# EAGLE design HiJack_ProtoBoard (EAGLE 5.09)
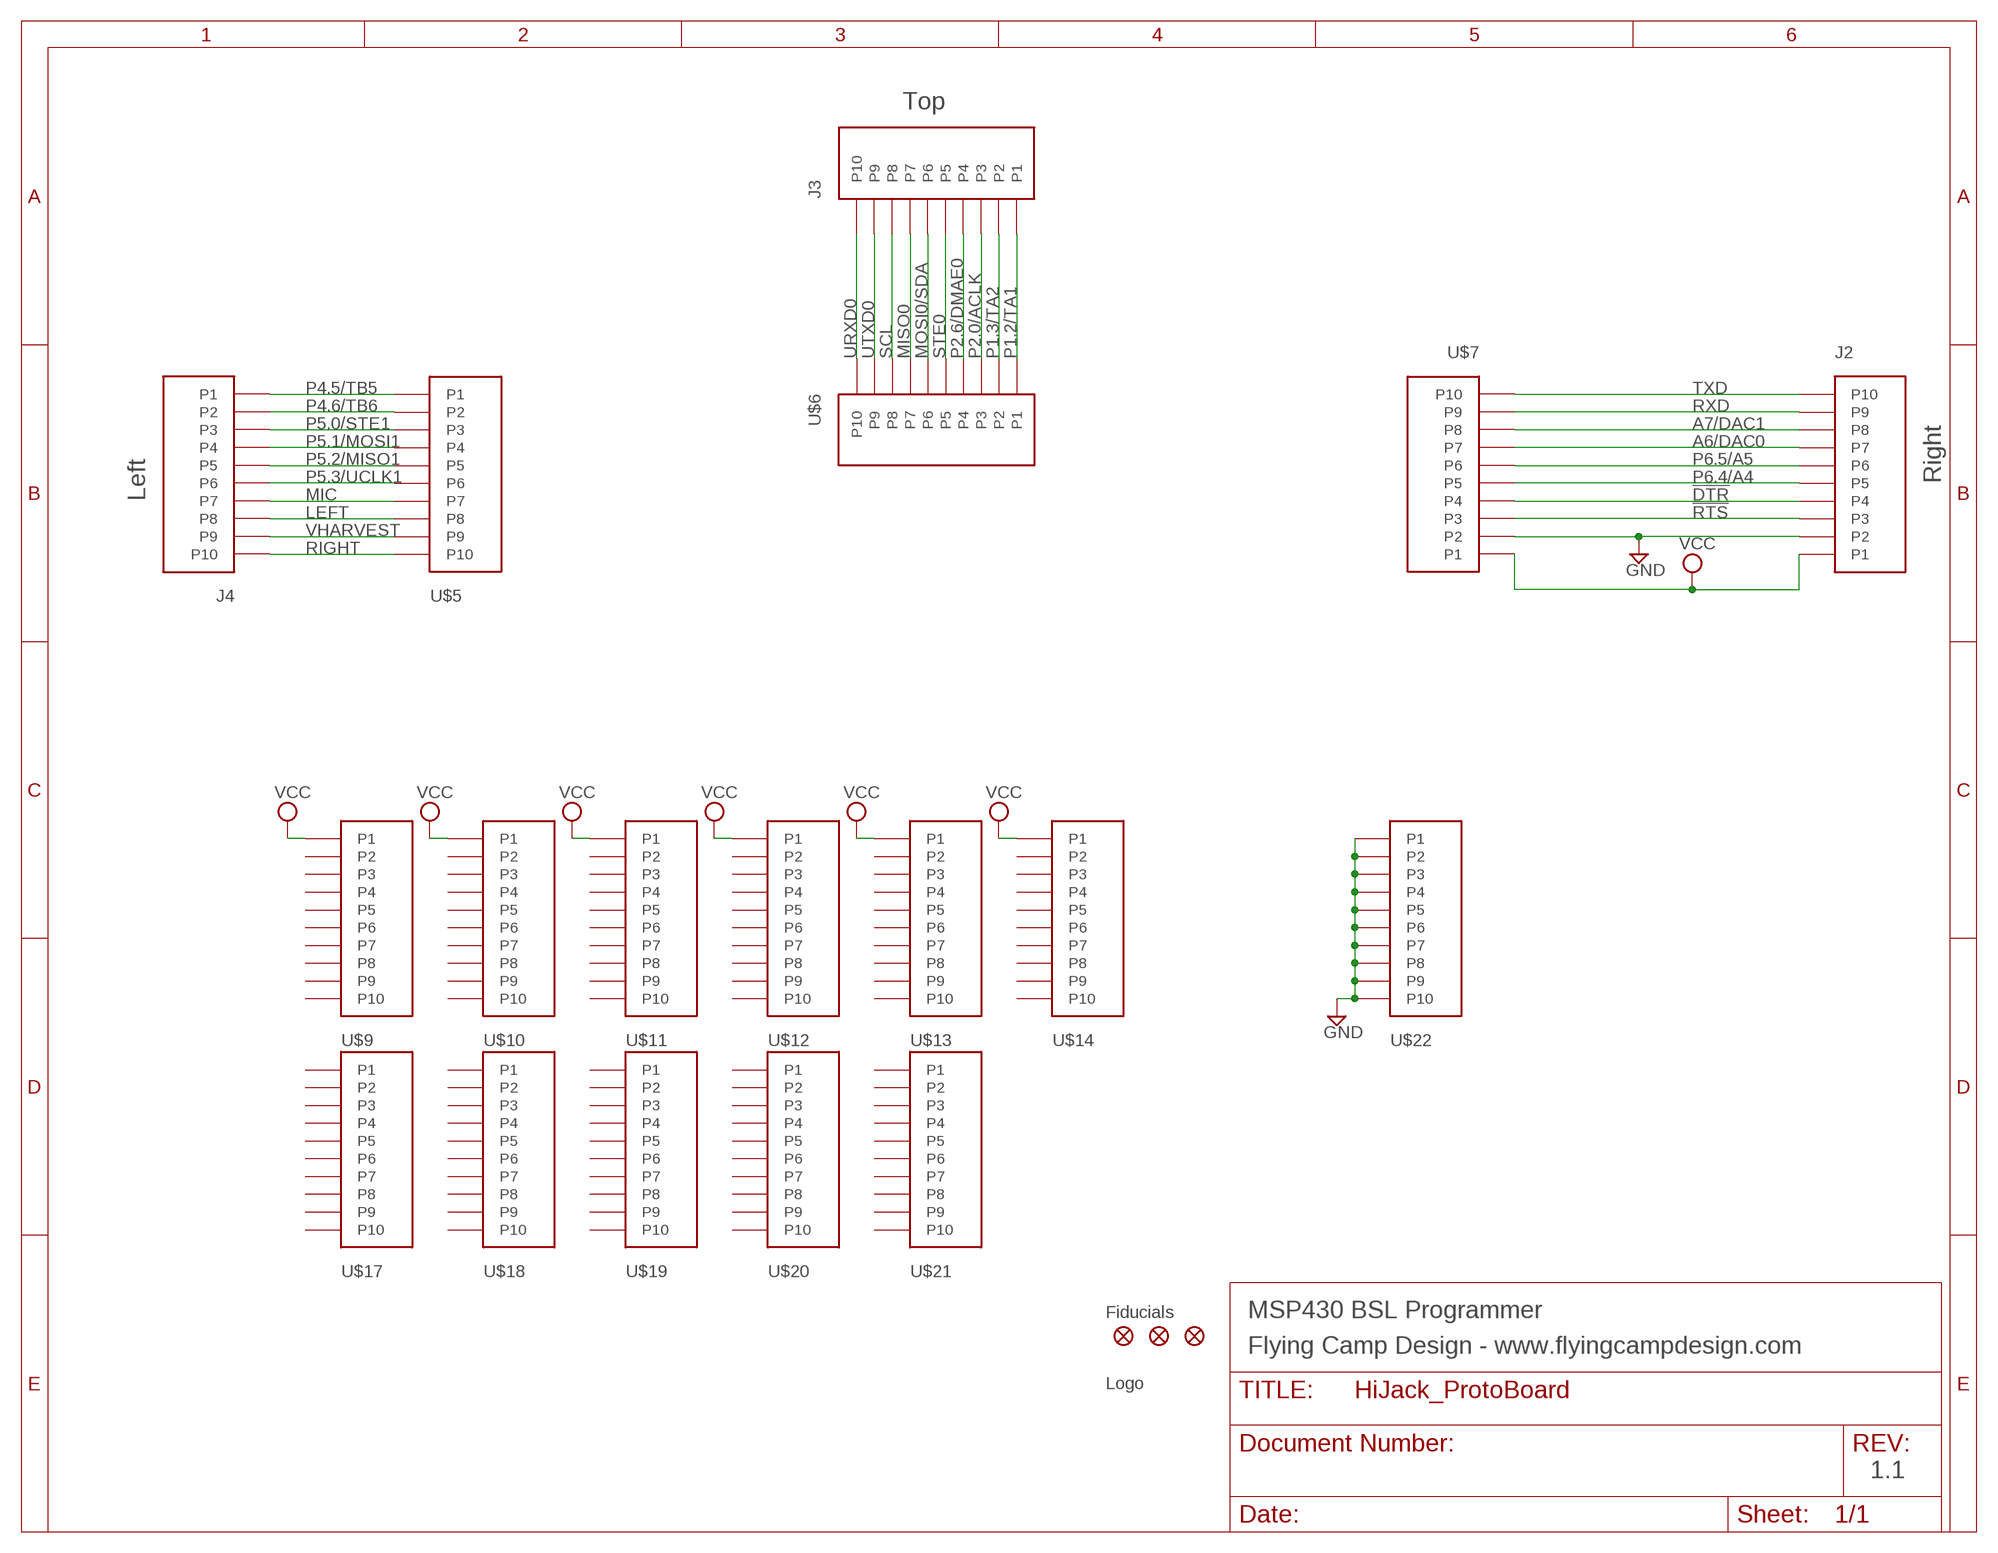
[diagram p0: schematic, sheet 1]

## Parts
J2  HEADER10POS  [10PIN2MMHEADER]
J3  HEADER10POS  [10PIN2MMHEADER]
J4  HEADER10POS  [10PIN2MMHEADER]
U$2  FIDUCIAL1X2  [FIDUCIAL-1X2]
U$3  FIDUCIAL1X2  [FIDUCIAL-1X2]
U$4  FIDUCIAL1X2  [FIDUCIAL-1X2]
U$5  PROTO10POS  [10PINPROTO]
U$6  PROTO10POS  [10PINPROTO]
U$7  PROTO10POS  [10PINPROTO]
U$9  PROTO10POS  [10PINPROTO]
U$10  PROTO10POS  [10PINPROTO]
U$11  PROTO10POS  [10PINPROTO]
U$12  PROTO10POS  [10PINPROTO]
U$13  PROTO10POS  [10PINPROTO]
U$14  PROTO10POS  [10PINPROTO]
U$17  PROTO10POS  [10PINPROTO]
U$18  PROTO10POS  [10PINPROTO]
U$19  PROTO10POS  [10PINPROTO]
U$20  PROTO10POS  [10PINPROTO]
U$21  PROTO10POS  [10PINPROTO]
U$22  PROTO10POS  [10PINPROTO]

## Nets
!DTR: J2.P4 U$7.P4
!RTS: J2.P3 U$7.P3
A6/DAC0: J2.P7 U$7.P7
A7/DAC1: J2.P8 U$7.P8
GND [power]: J2.P2 U$7.P2 U$22.P1 U$22.P2 U$22.P3 U$22.P4 U$22.P5 U$22.P6 U$22.P7 U$22.P8 U$22.P9 U$22.P10
LEFT: J4.P8 U$5.P8
MIC: J4.P7 U$5.P7
MISO0: J3.P7 U$6.P7
MOSI0/SDA: J3.P6 U$6.P6
P1.2/TA1: J3.P1 U$6.P1
P1.3/TA2: J3.P2 U$6.P2
P2.0/ACLK: J3.P3 U$6.P3
P2.6/DMAE0: J3.P4 U$6.P4
P4.5/TB5: J4.P1 U$5.P1
P4.6/TB6: J4.P2 U$5.P2
P5.0/STE1: J4.P3 U$5.P3
P5.1/MOSI1: J4.P4 U$5.P4
P5.2/MISO1: J4.P5 U$5.P5
P5.3/UCLK1: J4.P6 U$5.P6
P6.4/A4: J2.P5 U$7.P5
P6.5/A5: J2.P6 U$7.P6
RIGHT: J4.P10 U$5.P10
RXD: J2.P9 U$7.P9
SCL: J3.P8 U$6.P8
STE0: J3.P5 U$6.P5
TXD: J2.P10 U$7.P10
URXD0: J3.P10 U$6.P10
UTXD0: J3.P9 U$6.P9
VCC: J2.P1 U$7.P1 U$9.P1 U$10.P1 U$11.P1 U$12.P1 U$13.P1 U$14.P1
VHARVEST: J4.P9 U$5.P9
Unconnected: U$9.P2 U$9.P3 U$9.P4 U$9.P5 U$9.P6 U$9.P7 U$9.P8 U$9.P9 U$9.P10 U$10.P2 U$10.P3 U$10.P4 U$10.P5 U$10.P6 U$10.P7 U$10.P8 U$10.P9 U$10.P10 U$11.P2 U$11.P3 U$11.P4 U$11.P5 U$11.P6 U$11.P7 U$11.P8 U$11.P9 U$11.P10 U$12.P2 U$12.P3 U$12.P4 U$12.P5 U$12.P6 U$12.P7 U$12.P8 U$12.P9 U$12.P10 U$13.P2 U$13.P3 U$13.P4 U$13.P5 U$13.P6 U$13.P7 U$13.P8 U$13.P9 U$13.P10 U$14.P2 U$14.P3 U$14.P4 U$14.P5 U$14.P6 U$14.P7 U$14.P8 U$14.P9 U$14.P10 U$17.P1 U$17.P2 U$17.P3 U$17.P4 U$17.P5 U$17.P6 U$17.P7 U$17.P8 U$17.P9 U$17.P10 U$18.P1 U$18.P2 U$18.P3 U$18.P4 U$18.P5 U$18.P6 U$18.P7 U$18.P8 U$18.P9 U$18.P10 U$19.P1 U$19.P2 U$19.P3 U$19.P4 U$19.P5 U$19.P6 U$19.P7 U$19.P8 U$19.P9 U$19.P10 U$20.P1 U$20.P2 U$20.P3 U$20.P4 U$20.P5 U$20.P6 U$20.P7 U$20.P8 U$20.P9 U$20.P10 U$21.P1 U$21.P2 U$21.P3 U$21.P4 U$21.P5 U$21.P6 U$21.P7 U$21.P8 U$21.P9 U$21.P10

## Notes on the sheet
- Top
- Right
- Left
- Fiducials | MSP430 BSL Programmer
- Flying Camp Design - www.flyingcampdesign.com
- Logo
- 1.1

## Library data of the parts
J2-J4 = hijack:HEADER10POS: Fits 3M 950510-6102-AR
U$2-U$4 = SparkFun:FIDUCIAL: Fiducial Alignment Points Various fiducial points for machine vision alignment.
U$5-U$7 U$9-U$14 U$17-U$22 = hijack:PROTO10POS

## Net classes
1 power: width 0.635 mm, clearance 0.406 mm

## Board
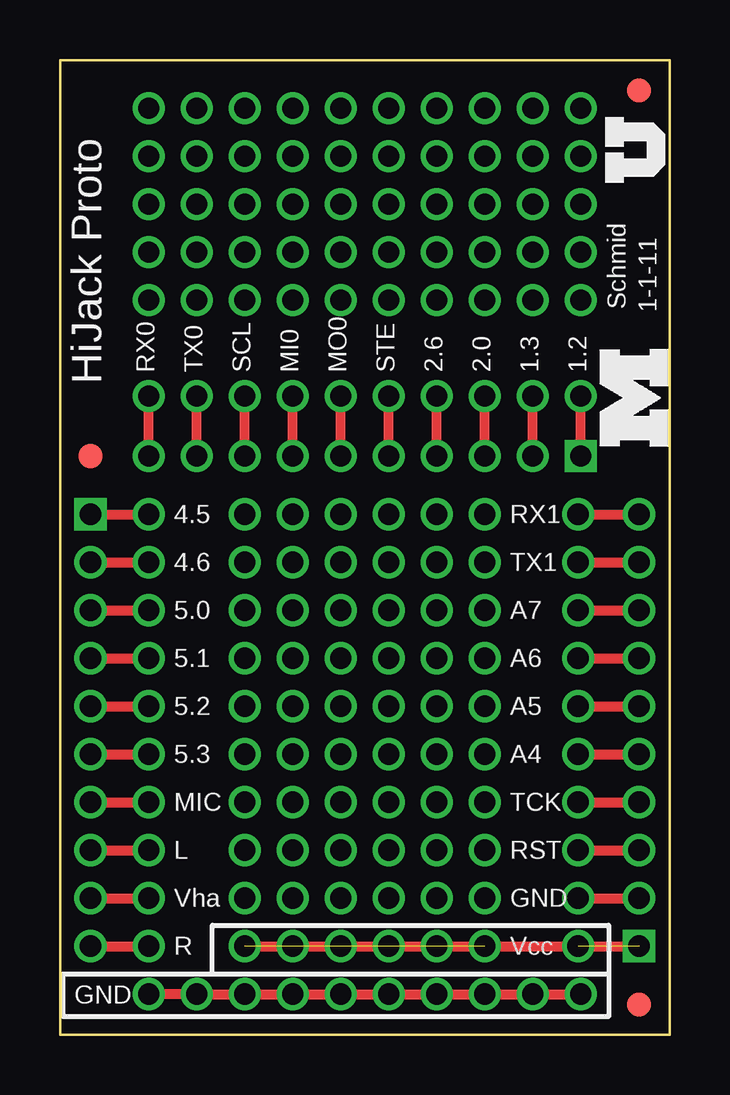
[diagram p1: board, top side]
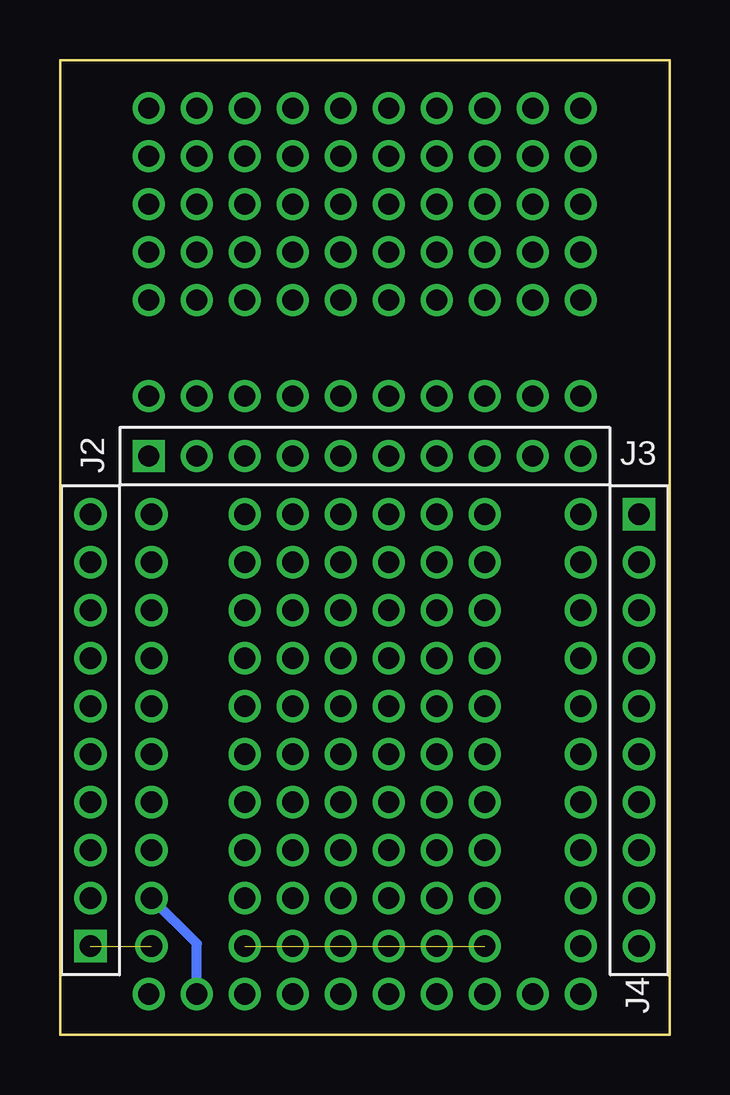
[diagram p2: board, bottom side, seen from below]

Size 25.4 x 40.64 mm. Coordinates in mm from the lower left corner, seen from the top.
Outline: 0,0 0,40.64 25.4,40.64 25.4,0 0,0
Copper layers (1*16): Top 0.0178mm / dielectric 1.4986mm / Bottom 0.0178mm
Design rules "SSC-EAGLE-2Lyr_v1.0.0.3": minimum track width 6mil, minimum drill 14mil, track to track 6mil, track to pad 6mil, pad to pad 6mil, via to via 6mil, smd to smd 6mil, copper to edge 20mil, drill to drill 16mil, minimum pad ring 8mil, minimum via ring 8mil, stop-mask expansion 3mil, vias tented up to drill 0mil, thermal gap 10mil

### Footprints (pad centres in the part's own frame; a part is rotated, then mirrored left to right if it is on the bottom)
10PIN2MMHEADER = drill 0.89 pad 1.346 square: P1 -9,0 | drill 0.89 pad 1.346 round: P2 -7,0; P3 -5,0; P4 -3,0; P5 -1,0; P6 1,0; P7 3,0; P8 5,0; P9 7,0; P10 9,0
FIDUCIAL-1X2 = smd 1 x 1: 1 0,0
10PINPROTO = drill 0.89 pad 1.346 round: P1 -9,0; P2 -7,0; P3 -5,0; P4 -3,0; P5 -1,0; P6 1,0; P7 3,0; P8 5,0; P9 7,0; P10 9,0

### Placement (x,y rotation side)
J2  24.13,12.7 90 bottom
J3  12.7,24.13 0 bottom
J4  1.27,12.7 270 bottom
U$1  [BLOCK-M]  25.4,24.51 90 top
U$2  1.27,24.13 0 top
U$3  24.13,39.37 0 top
U$4  24.13,1.27 0 top
U$5  3.7,12.7 270 top
U$6  12.7,26.63 180 top
U$7  21.59,12.7 90 top
U$8  [UTAH_LOGO]  25.2,35.53 90 top
U$9  7.7,12.7 90 top
U$10  9.7,12.7 90 top
U$11  11.7,12.7 90 top
U$12  13.7,12.7 90 top
U$13  15.7,12.7 90 top
U$14  17.7,12.7 90 top
U$17  12.7,30.63 0 top
U$18  12.7,32.63 0 top
U$19  12.7,34.63 0 top
U$20  12.7,36.63 0 top
U$21  12.7,38.63 0 top
U$22  12.7,1.7 0 top

### Tracks (layer width: path | path; a pad name or v marks a point on that pad's centre or on a via)
!DTR
  Top 0.406: U$7.P4 J2.P4
!RTS
  Top 0.406: U$7.P3 J2.P3
A6/DAC0
  Top 0.406: U$7.P7 J2.P7
A7/DAC1
  Top 0.406: U$7.P8 J2.P8
GND
  Top 0.406: U$7.P2 J2.P2 | U$22.P10 U$22.P9 U$22.P8 U$22.P7 U$22.P6 U$22.P5 U$22.P4 U$22.P3 U$22.P2 U$22.P1
  Bottom 0.406: U$7.P2 19.7,3.81 U$22.P9
LEFT
  Top 0.406: J4.P8 U$5.P8
MIC
  Top 0.406: J4.P7 U$5.P7
MISO0
  Top 0.406: J3.P7 U$6.P7
MOSI0/SDA
  Top 0.406: J3.P6 U$6.P6
P1.2/TA1
  Top 0.406: J3.P1 U$6.P1
P1.3/TA2
  Top 0.406: J3.P2 U$6.P2
P2.0/ACLK
  Top 0.406: J3.P3 U$6.P3
P2.6/DMAE0
  Top 0.406: J3.P4 U$6.P4
P4.5/TB5
  Top 0.406: J4.P1 U$5.P1
P4.6/TB6
  Top 0.406: J4.P2 U$5.P2
P5.0/STE1
  Top 0.406: J4.P3 U$5.P3
P5.1/MOSI1
  Top 0.406: J4.P4 U$5.P4
P5.2/MISO1
  Top 0.406: J4.P5 U$5.P5
P5.3/UCLK1
  Top 0.406: J4.P6 U$5.P6
P6.4/A4
  Top 0.406: U$7.P5 J2.P5
P6.5/A5
  Top 0.406: U$7.P6 J2.P6
RIGHT
  Top 0.406: J4.P10 U$5.P10
RXD
  Top 0.406: U$7.P9 J2.P9
SCL
  Top 0.406: J3.P8 U$6.P8
STE0
  Top 0.406: J3.P5 U$6.P5
TXD
  Top 0.406: U$7.P10 J2.P10
URXD0
  Top 0.406: J3.P10 U$6.P10
UTXD0
  Top 0.406: J3.P9 U$6.P9
VCC  (6 unrouted)
  Top 0.406: U$9.P1 J2.P1
VHARVEST
  Top 0.406: J4.P9 U$5.P9

### Text on the board
tPlace: Schmid | 1-1-11 | RX0 | TX0 | SCL | MI0 | MO0 | STE | 2.6 | 2.0 | 1.3 | 1.2 | HiJack Proto | 4.5 | RX1 | 4.6 | TX1 | 5.0 | A7 | 5.1 | A6 | 5.2 | A5 | 5.3 | A4 | MIC | TCK | L | RST | Vha | GND | R | Vcc | GND